# EAGLE schematic pizero-boardtest (EAGLE 9.3.1)
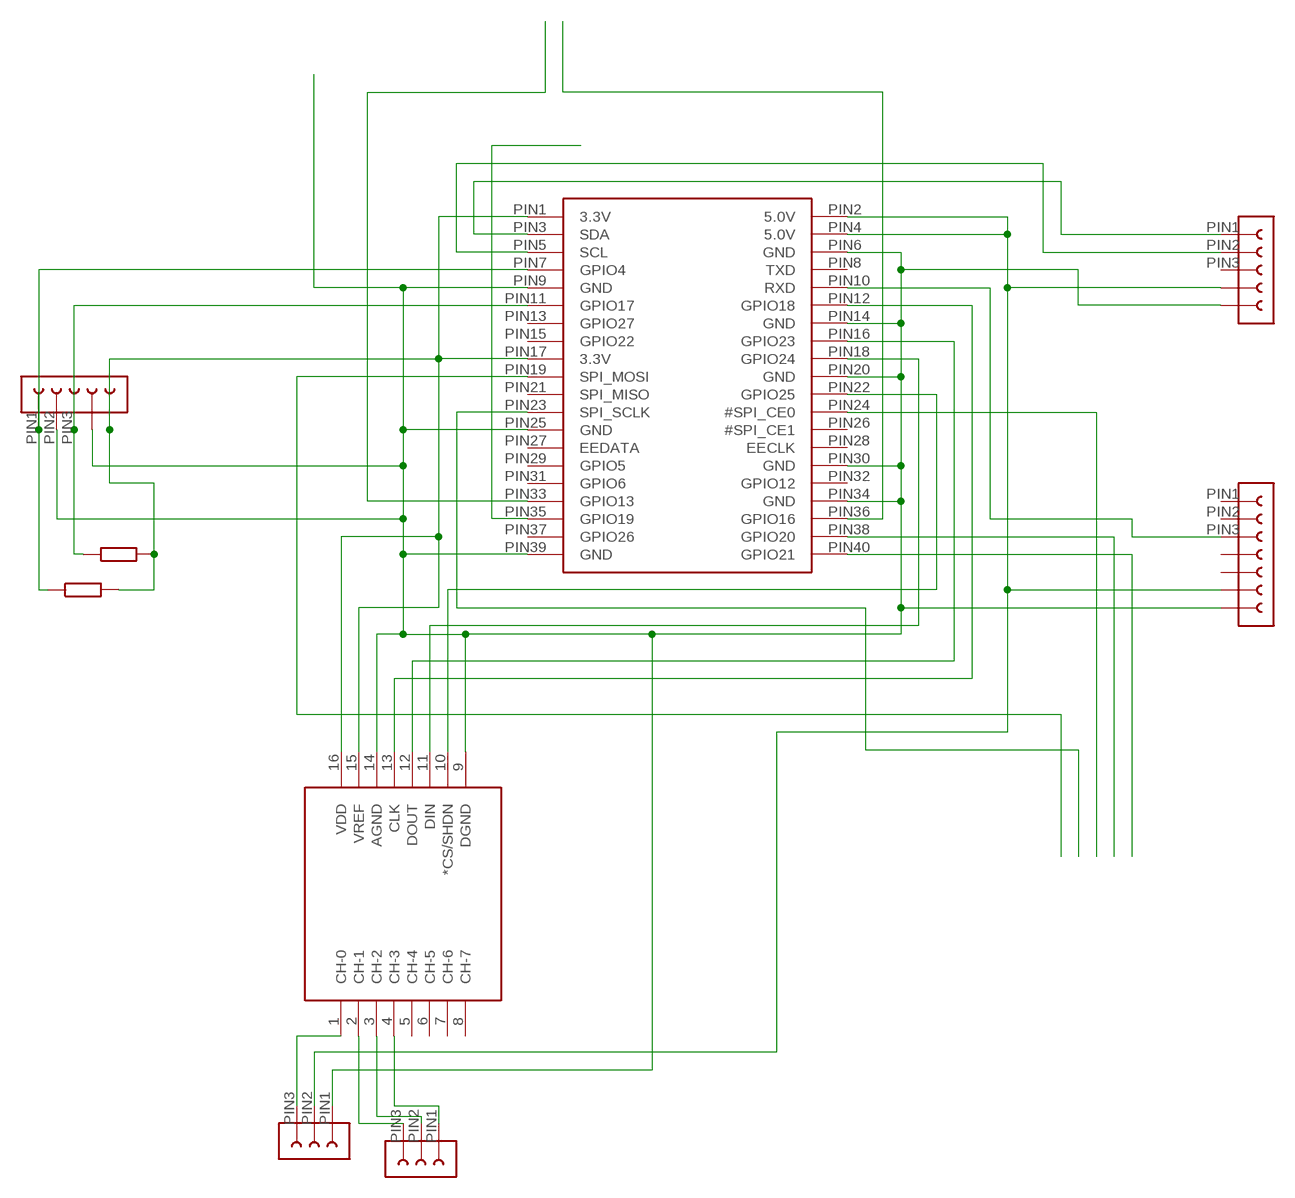
[diagram p0: schematic, sheet 1]

## Parts
ADC  ADC-CHIP  [MCP3008-I/SL]
U$1  RPI-CPU  [RPI-CPU]
U$2  3PIN-HEADER  [3PIN-HEADER]
U$3  5PIN-HEADER  [5PIN-HEADER]
U$4  10KO-RESISTOR  [10KO-RESISTOR]
U$5  10KO-RESISTOR  [10KO-RESISTOR]
U$6  3PIN-HEADER  [3PIN-HEADER]
U$8  5PIN-HEADER  [5PIN-HEADER]
U$9  7PIN-HEADER  [7PIN-HEADER]

## Nets
3.3V: ADC.15(VREF) ADC.16(VDD) U$1.PIN1(3.3V) U$1.PIN17(3.3V) U$3.PIN5 U$4.P$2 U$5.P$2
5.0V: U$1.PIN2(5.0V) U$1.PIN4(5.0V) U$6.PIN2 U$8.PIN4 U$9.PIN6
CE0: U$1.PIN24(#SPI_CE0)
GND: ADC.9(DGND) ADC.14(AGND) U$1.PIN6(GND) U$1.PIN9(GND) U$1.PIN14(GND) U$1.PIN20(GND) U$1.PIN25(GND) U$1.PIN30(GND) U$1.PIN34(GND) U$1.PIN39(GND) U$3.PIN2 U$3.PIN4 U$6.PIN1 U$8.PIN5 U$9.PIN7
GPIO4: U$1.PIN7(GPIO4) U$3.PIN1 U$5.P$1
GPIO13: U$1.PIN33(GPIO13)
GPIO16: U$1.PIN36(GPIO16)
GPIO17: U$1.PIN11(GPIO17) U$3.PIN3 U$4.P$1
GPIO18: ADC.13(CLK) U$1.PIN12(GPIO18)
GPIO19: U$1.PIN35(GPIO19)
GPIO20: U$1.PIN38(GPIO20)
GPIO21: U$1.PIN40(GPIO21)
GPIO23: ADC.12(DOUT) U$1.PIN16(GPIO23)
GPIO24: ADC.11(DIN) U$1.PIN18(GPIO24)
GPIO25: ADC.10(*CS/SHDN) U$1.PIN22(GPIO25)
MOSI: U$1.PIN19(SPI_MOSI)
N$1: ADC.1(CH-0) U$6.PIN3
N$2: ADC.2(CH-1) U$2.PIN3
N$3: ADC.3(CH-2) U$2.PIN2
N$4: ADC.4(CH-3) U$2.PIN1
RXD: U$1.PIN10(RXD) U$9.PIN3
SCL: U$1.PIN5(SCL) U$8.PIN2
SCLK: U$1.PIN23(SPI_SCLK)
SDA: U$1.PIN3(SDA) U$8.PIN1
Unconnected: ADC.5(CH-4) ADC.6(CH-5) ADC.7(CH-6) ADC.8(CH-7) U$1.PIN8(TXD) U$1.PIN13(GPIO27) U$1.PIN15(GPIO22) U$1.PIN21(SPI_MISO) U$1.PIN26(#SPI_CE1) U$1.PIN27(EEDATA) U$1.PIN28(EECLK) U$1.PIN29(GPIO5) U$1.PIN31(GPIO6) U$1.PIN32(GPIO12) U$1.PIN37(GPIO26) U$8.PIN3 U$9.PIN1 U$9.PIN2 U$9.PIN4 U$9.PIN5

## Library data of the parts
ADC = dosenet-pihat:ADC-CHIP
U$1 = dosenet-pihat:RPI-CPU
U$2 U$6 = dosenet-pihat:3PIN-HEADER
U$3 U$8 = dosenet-pihat:5PIN-HEADER
U$4 U$5 = dosenet-pihat:10KO-RESISTOR
U$9 = dosenet-pihat:7PIN-HEADER